# Altium schematic sheet Relay_SPDT.SchDoc
size 106 x 88 mm
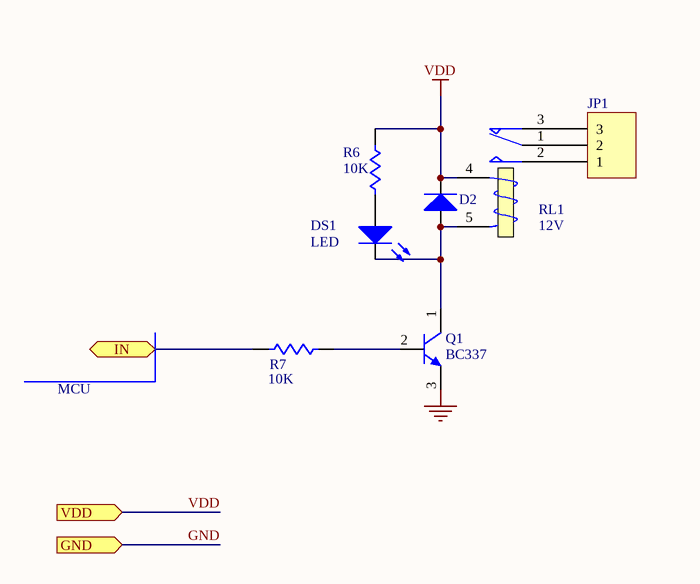
[diagram p0: Relay_SPDT.SchDoc]

## Parts
D2  Diode  [DIODE-0.4]  (value not drawn)
DS1  LED  [LED-5mm_Red]
JP1  Header 3  [Fonics_3C]  (value not drawn)
Q1  BC337  [TO92C]
R6  value 10K  [AXIAL-0.4]  (hidden comment: Res1)
R7  value 10K  [AXIAL-0.4]  (hidden comment: Res1)
RL1  value 12V  [RELAY-SPDT-1]  (hidden comment: Relay-SPDT_2)

## Ports
GND, IN, VDD

## Nets
GND: Q1.3(E) ; port GND
VDD: D2.2(K) R6.1 RL1.4(T1) ; port VDD
IN: R7.2 ; port IN
NetD2_1: D2.1(A) DS1.2(K) Q1.1(C) RL1.5(T2)
NetDS1_1: DS1.1(A) R6.2
NetJP1_1: JP1.1 RL1.2(NO)
NetJP1_2: JP1.2 RL1.1(COM)
NetJP1_3: JP1.3 RL1.3(NC)
NetQ1_2: Q1.2(B) R7.1

## Notes on the sheet
- MCU

## Library data of the parts
D2 = Diode: Default Diode; Manufacturer: Generic Components; Class I: Discrete; Class II: Diode - Switching; Published: 8-Jun-2000; Revision: July-2002: Re-released for DXP Platform.; Publisher: Altium Limited
DS1 = LED: Typical INFRARED GaAs LED; Manufacturer: Generic Components; Class I: Optoelectronic; Published: 8-Jun-2000; Revision: July-2002: Re-released for DXP Platform.; Publisher: Altium Limited; Class II: LED
JP1 = Header 3: Header, 3-Pin; Manufacturer: Generic Components; Class I: Connector; Revision: July-2002: Re-released for DXP Platform.; Publisher: Altium Limited
Q1 = NPN: NPN Bipolar Transistor; Manufacturer: Generic Components; Class I: Discrete; Class II: BJT - Low Power; Published: 8-Jun-2000; Revision: July-2002: Re-released for DXP Platform.; Publisher: Altium Limited
R6 R7 = Res1: Resistor; Manufacturer: Generic Components; Class I: Passive; Published: 8-Jun-2000; Revision: July-2002: Re-released for DXP Platform.; Publisher: Altium Limited; Class II: Resistor
RL1 = Relay-SPDT_2: SPDT Relay; Manufacturer: Generic Components; Class I: Electro-mechanical; Published: 8-Jun-2000; Revision: July-2002: Re-released for DXP Platform.; Publisher: Altium Limited; Class II: Relay